# EAGLE schematic 526_AI_BLOCKS_Rev200 (EAGLE 9.6.2)
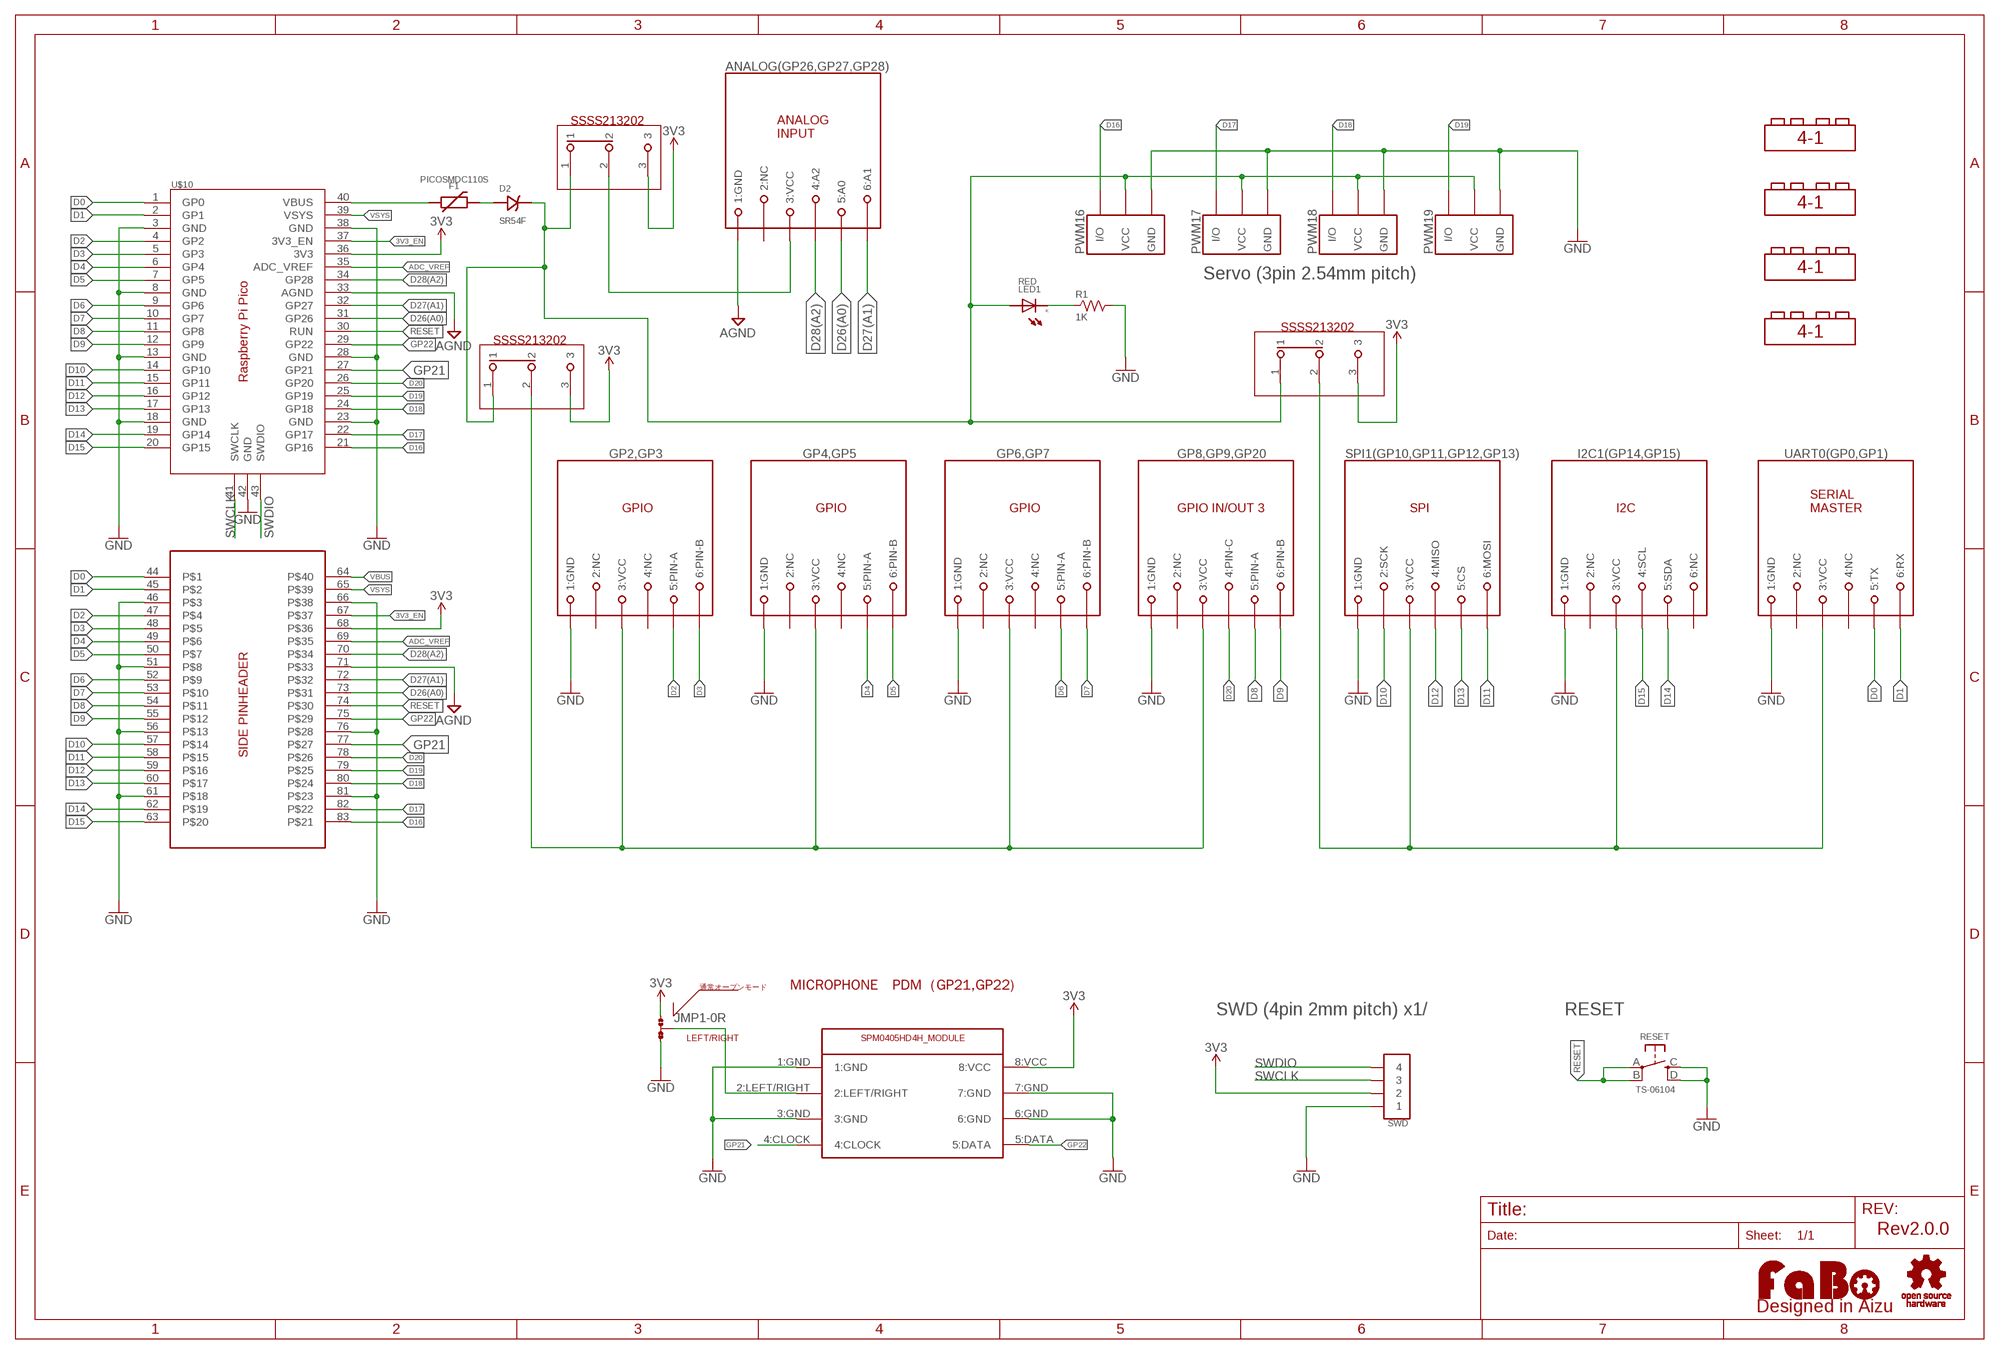
[diagram p0: schematic, sheet 1]

## Parts
ANALOG(GP26,GP27,GP28)  MODULAR-JACK-6P-RJ11_ANALOG3  [7002-6PXC-X]
D2  SR54F  [SMBF]
F1  PICOSMDC110S  [SMDC110S]
GP2,GP3  MODULAR-JACK-6P-RJ11_GPIO  [7002-6PXC-X]
GP4,GP5  MODULAR-JACK-6P-RJ11_GPIO  [7002-6PXC-X]
GP6,GP7  MODULAR-JACK-6P-RJ11_GPIO  [7002-6PXC-X]
GP8,GP9,GP20  MODULAR-JACK-6P-RJ11_GPIO3  [7002-6PXC-X]
I2C1(GP14,GP15)  MODULAR-JACK-6P-RJ11_I2C  [7002-6PXC-X]
JMP1  0R-JUMPB  [B0R-JMP]
LED1  RED  LED-0603  [0603]
LOGO1  LOGO_OSHW-M_BOTTOM  [LOGO_OSHW_M_BOTTOM]
LOGO2  LOGO_FABO-M  [LOGO_FABO_M]
PWM16  FABO_BRICK_3PIN-HEADER  [FABO_BRICK_3PIN_HEADER]
PWM17  FABO_BRICK_3PIN-HEADER  [FABO_BRICK_3PIN_HEADER]
PWM18  FABO_BRICK_3PIN-HEADER  [FABO_BRICK_3PIN_HEADER]
PWM19  FABO_BRICK_3PIN-HEADER  [FABO_BRICK_3PIN_HEADER]
R1  1K  RESISTOR-0603  [0603]
RESET  TS-06104  [TS-06104]
SPI1(GP10,GP11,GP12,GP13)  MODULAR-JACK-6P-RJ11_SPI  [7002-6PXC-X]
SWD  SMD-CONN-4PIN-SM04B-PASS  [SM04B-PASS]
U$1  SSSS213202  [SSSS213202]
U$2  SSSS213202  [SSSS213202]
U$4  BLOCK_4-1  [4-1BLOCK]
U$5  BLOCK_4-1  [4-1BLOCK]
U$6  BLOCK_4-1  [4-1BLOCK]
U$7  BLOCK_4-1  [4-1BLOCK]
U$8  SSSS213202  [SSSS213202]
U$9  SPM0405HD4HMODULE  [MICROPHONE8PINMODULE]
U$10  RASPBERRY_PI_PICO_BOTH_TH_PINHEADER  [RASPBERRY_PI_PICO_HEADER_BOTH]
UART0(GP0,GP1)  MODULAR-JACK-6P-RJ11_SERIAL_M  [7002-6PXC-X]

## Nets
3V3: JMP1.1 SWD.2 U$1.3 U$2.3 U$8.3 U$9.8:VCC U$10.36(3V3) U$10.68
3V3_EN: U$10.37(3V3_EN) U$10.67
5V: D2.CATHODE LED1.ANODE PWM16.VCC PWM17.VCC PWM18.VCC PWM19.VCC U$1.1 U$2.1 U$8.1
ADC_VREF: U$10.35(ADC_VREF) U$10.69
AGND: ANALOG(GP26,GP27,GP28).1(1:GND) U$10.33(AGND) U$10.71
D0: U$10.1(GP0) U$10.44 UART0(GP0,GP1).5(5:TX)
D1: U$10.2(GP1) U$10.45 UART0(GP0,GP1).6(6:RX)
D2: GP2,GP3.5(5:PIN-A) U$10.4(GP2) U$10.47
D3: GP2,GP3.6(6:PIN-B) U$10.5(GP3) U$10.48
D4: GP4,GP5.5(5:PIN-A) U$10.6(GP4) U$10.49
D5: GP4,GP5.6(6:PIN-B) U$10.7(GP5) U$10.50
D6: GP6,GP7.5(5:PIN-A) U$10.9(GP6) U$10.52
D7: GP6,GP7.6(6:PIN-B) U$10.10(GP7) U$10.53
D8: GP8,GP9,GP20.5(5:PIN-A) U$10.11(GP8) U$10.54
D9: GP8,GP9,GP20.6(6:PIN-B) U$10.12(GP9) U$10.55
D10: SPI1(GP10,GP11,GP12,GP13).2(2:SCK) U$10.14(GP10) U$10.57
D11: SPI1(GP10,GP11,GP12,GP13).6(6:MOSI) U$10.15(GP11) U$10.58
D12: SPI1(GP10,GP11,GP12,GP13).4(4:MISO) U$10.16(GP12) U$10.59
D13: SPI1(GP10,GP11,GP12,GP13).5(5:CS) U$10.17(GP13) U$10.60
D14: I2C1(GP14,GP15).5(5:SDA) U$10.19(GP14) U$10.62
D15: I2C1(GP14,GP15).4(4:SCL) U$10.20(GP15) U$10.63
D16: PWM16.I/O U$10.21(GP16) U$10.83
D17: PWM17.I/O U$10.22(GP17) U$10.82
D18: PWM18.I/O U$10.24(GP18) U$10.80
D19: PWM19.I/O U$10.25(GP19) U$10.79
D20: GP8,GP9,GP20.4(4:PIN-C) U$10.26(GP20) U$10.78
D26(A0): ANALOG(GP26,GP27,GP28).5(5:A0) U$10.31(GP26) U$10.73
D27(A1): ANALOG(GP26,GP27,GP28).6(6:A1) U$10.32(GP27) U$10.72
D28(A2): ANALOG(GP26,GP27,GP28).4(4:A2) U$10.34(GP28) U$10.70
GND: GP2,GP3.1(1:GND) GP4,GP5.1(1:GND) GP6,GP7.1(1:GND) GP8,GP9,GP20.1(1:GND) I2C1(GP14,GP15).1(1:GND) JMP1.3 PWM16.GND PWM17.GND PWM18.GND PWM19.GND R1.2 RESET.C RESET.D SPI1(GP10,GP11,GP12,GP13).1(1:GND) SWD.1 U$9.1:GND U$9.3:GND U$9.6:GND U$9.7:GND U$10.3(GND) U$10.8(GND) U$10.13(GND) U$10.18(GND) U$10.23(GND) U$10.28(GND) U$10.38(GND) U$10.42(GND) U$10.46 U$10.51 U$10.56 U$10.61 U$10.66 U$10.76 U$10.81 UART0(GP0,GP1).1(1:GND)
GP21: U$9.4:CLOCK U$10.27(GP21) U$10.77
GP22: U$9.5:DATA U$10.29(GP22) U$10.75
N$1: LED1.CATHODE R1.1
N$2: ANALOG(GP26,GP27,GP28).3(3:VCC) U$1.2
N$3: I2C1(GP14,GP15).3(3:VCC) SPI1(GP10,GP11,GP12,GP13).3(3:VCC) U$8.2 UART0(GP0,GP1).3(3:VCC)
N$5: D2.ANODE F1.2
N$6: JMP1.2 U$9.2:LEFT/RIGHT
N$7: GP2,GP3.3(3:VCC) GP4,GP5.3(3:VCC) GP6,GP7.3(3:VCC) GP8,GP9,GP20.3(3:VCC) U$2.2
RESET: RESET.A RESET.B U$10.30(RUN) U$10.74
SWCLK: SWD.3 U$10.41(SWCLK)
SWDIO: SWD.4 U$10.43(SWDIO)
VBUS: F1.1 U$10.40(VBUS) U$10.64
VSYS: U$10.39(VSYS) U$10.65
Unconnected: ANALOG(GP26,GP27,GP28).2(2:NC) GP2,GP3.2(2:NC) GP2,GP3.4(4:NC) GP4,GP5.2(2:NC) GP4,GP5.4(4:NC) GP6,GP7.2(2:NC) GP6,GP7.4(4:NC) GP8,GP9,GP20.2(2:NC) I2C1(GP14,GP15).2(2:NC) I2C1(GP14,GP15).6(6:NC) UART0(GP0,GP1).2(2:NC) UART0(GP0,GP1).4(4:NC)

## Notes on the sheet
- SSSS213202
- Servo (3pin 2.54mm pitch)
- SSSS213202
- SSSS213202
- 通常オープンモード | MICROPHONE　PDM（GP21,GP22)
- SWD (4pin 2mm pitch) x1/ | RESET
- LEFT/RIGHT
- Rev2.0.0

## Library data of the parts
ANALOG(GP26,GP27,GP28) = FaBo-Connetor:MODULAR-JACK-6P-RJ11_ANALOG3
D2 = FaBo-Diode:SR54F: SURFACE MOUNT SCHOTTKY BARRIER RECTIFIER 40V Volts 5 Amperes SMBF molded plastic Forwaord Voltage 0.55V DC Reverse Current 0.1mA
F1 = FaBo-Thermistors:PICOSMDC110S
GP2,GP3 GP4,GP5 GP6,GP7 = FaBo-Connetor:MODULAR-JACK-6P-RJ11_GPIO
GP8,GP9,GP20 = FaBo-Connetor:MODULAR-JACK-6P-RJ11_GPIO3
I2C1(GP14,GP15) = FaBo-Connetor:MODULAR-JACK-6P-RJ11_I2C
JMP1 = jump-0r-smd:0R-JUMP: SMD 0R 0805 Jumper
LED1 = FaBo-LED:LED
LOGO1 = FaBo-Logo:LOGO_OSHW
LOGO2 = FaBo-Logo:LOGO_FABO
PWM16-PWM19 = FaBo-Template:FABO_BRICK_3PIN: FaBo Brick 3pin
R1 = FaBo-Resistors:RESISTOR: RESISTOR
RESET = FaBo-Switch:TS-06104
SPI1(GP10,GP11,GP12,GP13) = FaBo-Connetor:MODULAR-JACK-6P-RJ11_SPI
SWD = FaBo-Connetor:SMD-CONN-4PIN
U$1 U$2 U$8 = FaBo-Switch:SSSS213202
U$4-U$7 = FaBo-Block:BLOCK_4-1
U$9 = FaBo-ModulePin:SPM0405HD4HMODULE
U$10 = FaBo-Boards:RASPBERRY_PI_PICO_BOTH_TH_PINHEADER
UART0(GP0,GP1) = FaBo-Connetor:MODULAR-JACK-6P-RJ11_SERIAL_M